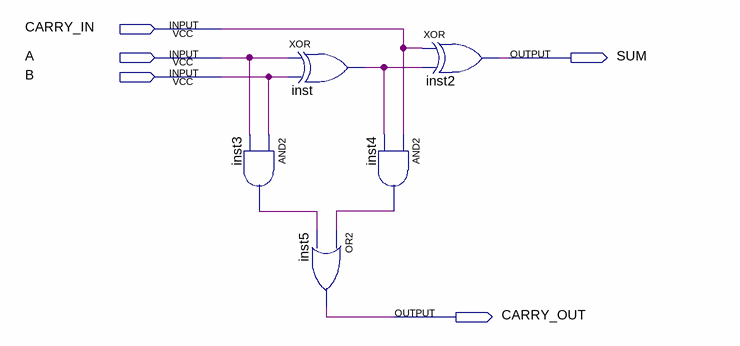
[diagram p0: schematic sheet]
// Quartus schematic FULL_ADDER_1bit.bdf as structural Verilog: 5 symbols, 5 pins
module FULL_ADDER_1bit (
  input  CARRY_IN,
  input  A,
  input  B,
  output SUM,
  output CARRY_OUT
);

  wire inst3_out, inst4_out, inst_out;

  and inst3 (inst3_out, B, A);
  xor inst (inst_out, A, B);
  or inst5 (CARRY_OUT, inst4_out, inst3_out);
  xor inst2 (SUM, CARRY_IN, inst_out);
  and inst4 (inst4_out, CARRY_IN, inst_out);
endmodule
